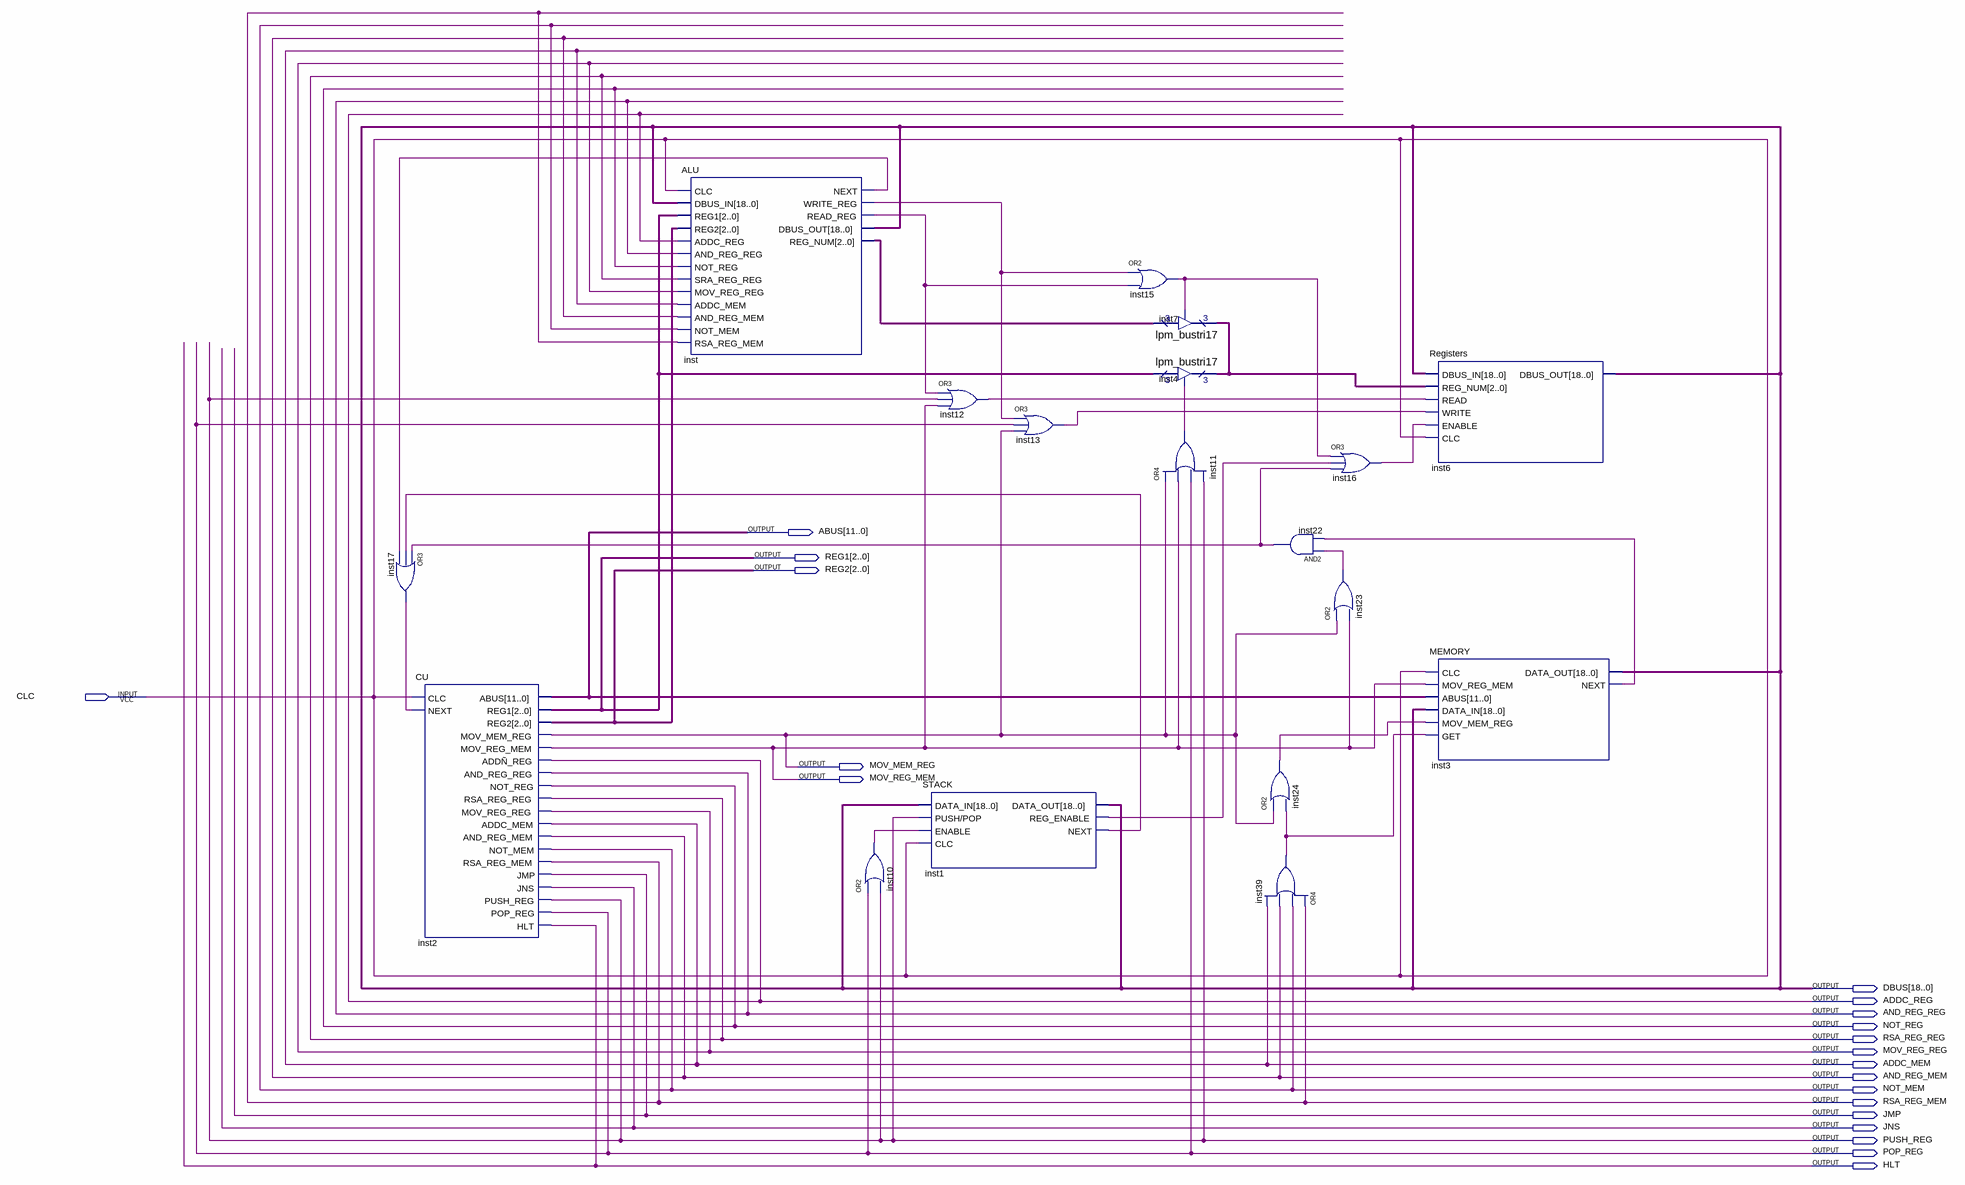
[diagram p0: schematic sheet]
// Quartus schematic course-project.bdf as structural Verilog: 18 symbols, 21 pins
module \course-project  (
  input  CLC,
  output [11:0] ABUS,
  output [2:0] REG1,
  output [2:0] REG2,
  output MOV_MEM_REG,
  output MOV_REG_MEM,
  output [18:0] DBUS,
  output ADDC_REG,
  output AND_REG_REG,
  output NOT_REG,
  output RSA_REG_REG,
  output MOV_REG_REG,
  output ADDC_MEM,
  output AND_REG_MEM,
  output NOT_MEM,
  output RSA_REG_MEM,
  output JMP,
  output JNS,
  output PUSH_REG,
  output POP_REG,
  output HLT
);

  wire inst1_next, inst1_reg_enable, inst3_next, inst10_out, inst11_out, inst12_out, inst13_out, inst15_out,
       inst16_out, inst17_out, inst22_out, inst23_out, inst24_out, inst39_out, inst_next, inst_read_reg,
       inst_write_reg;
  wire [2:0] inst7_tridata, inst_reg_num;

  or inst17 (inst17_out, inst22_out, inst1_next, inst_next);
  CU inst2 (
    .CLC(CLC), .NEXT(inst17_out), .ABUS(ABUS), .REG1(REG1), .REG2(REG2), .MOV_MEM_REG(MOV_MEM_REG),
    .MOV_REG_MEM(MOV_REG_MEM), .\ADDÑ_REG (ADDC_REG), .AND_REG_REG(AND_REG_REG), .NOT_REG(NOT_REG),
    .RSA_REG_REG(RSA_REG_REG), .MOV_REG_REG(MOV_REG_REG), .ADDC_MEM(ADDC_MEM), .AND_REG_MEM(AND_REG_MEM),
    .NOT_MEM(NOT_MEM), .RSA_REG_MEM(RSA_REG_MEM), .JMP(JMP), .JNS(JNS), .PUSH_REG(PUSH_REG),
    .POP_REG(POP_REG), .HLT(HLT));
  ALU inst (
    .CLC(CLC), .DBUS_IN(DBUS), .REG1(REG1), .REG2(REG2), .ADDC_REG(ADDC_REG), .AND_REG_REG(AND_REG_REG),
    .NOT_REG(NOT_REG), .SRA_REG_REG(RSA_REG_REG), .MOV_REG_REG(MOV_REG_REG), .ADDC_MEM(ADDC_MEM),
    .AND_REG_MEM(AND_REG_MEM), .NOT_MEM(NOT_MEM), .RSA_REG_MEM(RSA_REG_MEM), .NEXT(inst_next),
    .WRITE_REG(inst_write_reg), .READ_REG(inst_read_reg), .DBUS_OUT(DBUS), .REG_NUM(inst_reg_num));
  or inst10 (inst10_out, POP_REG, PUSH_REG);
  STACK inst1 (
    .DATA_IN(DBUS), .\PUSH/POP (PUSH_REG), .ENABLE(inst10_out), .CLC(CLC), .DATA_OUT(DBUS),
    .REG_ENABLE(inst1_reg_enable), .NEXT(inst1_next));
  or inst12 (inst12_out, inst_read_reg, PUSH_REG, MOV_REG_MEM);
  or inst13 (inst13_out, inst_write_reg, POP_REG, MOV_MEM_REG);
  or inst15 (inst15_out, inst_write_reg, inst_read_reg);
  lpm_bustri17 inst7 (.enabledt(inst15_out), .data(inst_reg_num), .tridata(inst7_tridata));
  lpm_bustri17 inst4 (.enabledt(inst11_out), .data(REG1), .tridata(inst7_tridata));
  or inst11 (inst11_out, MOV_MEM_REG, MOV_REG_MEM, POP_REG, PUSH_REG);
  and inst22 (inst22_out, inst23_out, inst3_next);
  or inst24 (inst24_out, MOV_MEM_REG, inst39_out);
  or inst39 (inst39_out, RSA_REG_MEM, NOT_MEM, AND_REG_MEM, ADDC_MEM);
  or inst16 (inst16_out, inst15_out, inst1_reg_enable, inst22_out);
  or inst23 (inst23_out, MOV_MEM_REG, MOV_REG_MEM);
  Registers inst6 (
    .DBUS_IN(DBUS), .REG_NUM(inst7_tridata), .READ(inst12_out), .WRITE(inst13_out), .ENABLE(inst16_out),
    .CLC(CLC), .DBUS_OUT(DBUS));
  MEMORY inst3 (
    .CLC(CLC), .MOV_REG_MEM(MOV_REG_MEM), .ABUS(ABUS), .DATA_IN(DBUS), .MOV_MEM_REG(inst24_out),
    .GET(inst39_out), .DATA_OUT(DBUS), .NEXT(inst3_next));
endmodule
